# Altium schematic sheet Relay.schdoc
size 291 x 195 mm
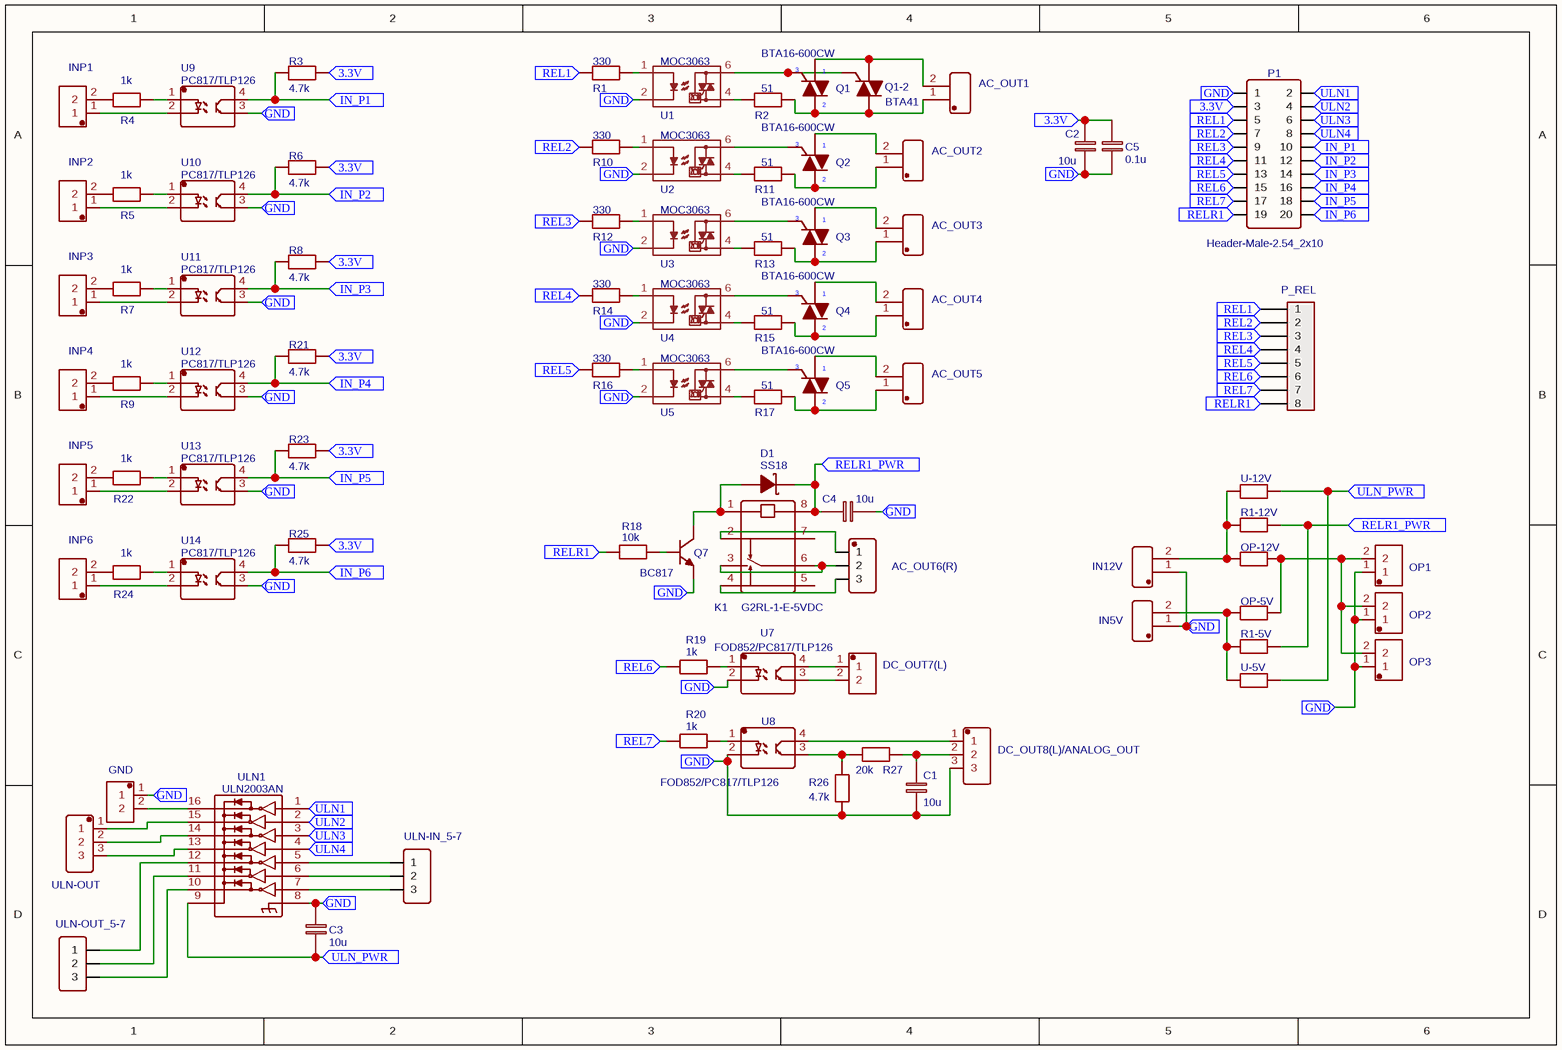
[diagram p0: Relay.schdoc]

## Parts
AC_OUT1  KF129_2P_5.08  [KF129_2P_5.08]  (value not drawn)
AC_OUT2  KF129_2P_5.08  [KF129_2P_5.08]  (value not drawn)
AC_OUT3  KF129_2P_5.08  [KF129_2P_5.08]  (value not drawn)
AC_OUT4  KF129_2P_5.08  [KF129_2P_5.08]  (value not drawn)
AC_OUT5  KF129_2P_5.08  [KF129_2P_5.08]  (value not drawn)
AC_OUT6(R)  KF129_3P_5.08  [KF129_3P_5.08]  (value not drawn)
C1  10u  [1206]
C2  10u  [1206]
C3  10u  [1206]
C4  10u  [1206]
C5  0.1u  [1206]
D1  SS18  [SMA(DO-214AC)]
DC_OUT7(L)  KF350-3.5mm-2p  [KF350-2P]  (value not drawn)
DC_OUT8(L)/ANALOG_OUT  KF350-3P  [KF350-3P]  (value not drawn)
GND  KF350-3.5mm-2p  [KF350-2P]  (value not drawn)
IN5V  KF128_2P_5.08  [KF128_2P_5.08]  (value not drawn)
IN12V  KF128_2P_5.08  [KF128_2P_5.08]  (value not drawn)
INP1  KF350-3.5mm-2p  [KF350-2P]  (value not drawn)
INP2  KF350-3.5mm-2p  [KF350-2P]  (value not drawn)
INP3  KF350-3.5mm-2p  [KF350-2P]  (value not drawn)
INP4  KF350-3.5mm-2p  [KF350-2P]  (value not drawn)
INP5  KF350-3.5mm-2p  [KF350-2P]  (value not drawn)
INP6  KF350-3.5mm-2p  [KF350-2P]  (value not drawn)
K1  G2RL-1-E-5VDC  [G2RL-1-E-CN DC24]
OP1  KF350-3.5mm-2p  [KF350-3.5MM-2P]  (value not drawn)
OP2  KF350-3.5mm-2p  [KF350-3.5MM-2P]  (value not drawn)
OP3  KF350-3.5mm-2p  [KF350-3.5MM-2P]  (value not drawn)
OP-5V  0  [0805]  (value not drawn)
OP-12V  0  [0805]  (value not drawn)
P1  Header-Male-2.54_2x10  [HDR-10X2/2.54]
P_REL  Header-Male-2.54_1x8 with numbers  [HDR-8X1/2.54]  (value not drawn)
Q1  BTA16-600CW  [TO-220(TO-220-3)]
Q1-2  BTA41  [TOP3-1]
Q2  BTA16-600CW  [TO-220(TO-220-3)]
Q3  BTA16-600CW  [TO-220(TO-220-3)]
Q4  BTA16-600CW  [TO-220(TO-220-3)]
Q5  BTA16-600CW  [TO-220(TO-220-3)]
Q7  BC817  [SOT-23(SOT-23-3)]
R1  330  [0805]
R1-5V  0  [0805]  (value not drawn)
R1-12V  0  [0805]  (value not drawn)
R2  51  [1206]
R3  4.7k  [0805]
R4  1k  [0805]
R5  1k  [0805]
R6  4.7k  [0805]
R7  1k  [0805]
R8  4.7k  [0805]
R9  1k  [0805]
R10  330  [0805]
R11  51  [1206]
R12  330  [0805]
R13  51  [1206]
R14  330  [0805]
R15  51  [1206]
R16  330  [0805]
R17  51  [1206]
R18  10k  [0805]
R19  1k  [0805]
R20  1k  [0805]
R21  4.7k  [0805]
R22  1k  [0805]
R23  4.7k  [0805]
R24  1k  [0805]
R25  4.7k  [0805]
R26  4.7k  [0805]
R27  20k  [1206]
U1  MOC3063  [DIP6]
U2  MOC3063  [DIP6]
U3  MOC3063  [DIP6]
U4  MOC3063  [DIP6]
U5  MOC3063  [DIP6]
U7  FOD852/PC817/TLP126  [PC817-DIP/SMD]
U8  FOD852/PC817/TLP126  [PC817-DIP/SMD]
U9  PC817/TLP126  [PC817-DIP/SMD]
U10  PC817/TLP126  [PC817-DIP/SMD]
U11  PC817/TLP126  [PC817-DIP/SMD]
U12  PC817/TLP126  [PC817-DIP/SMD]
U13  PC817/TLP126  [PC817-DIP/SMD]
U14  PC817/TLP126  [PC817-DIP/SMD]
U-5V  0  [0805]  (value not drawn)
U-12V  0  [0805]  (value not drawn)
ULN1  ULN2003AN  [DIP-16_16PIN-LS7.62-L19.69-W6.6-H5.08-PITCH2.54]
ULN-IN_5-7  Header-Male-2.54_1x3  [HDR-3X1/2.54]  (value not drawn)
ULN-OUT  KF350-3P  [KF350-3P]  (value not drawn)
ULN-OUT_5-7  Header-Male-2.54_1x3  [HDR-3X1/2.54]  (value not drawn)

## Ports
3.3V, GND, IN_P1, IN_P2, IN_P3, IN_P4, IN_P5, IN_P6, REL1, REL2, REL3, REL4, REL5, REL6, REL7, RELR1, RELR1_PWR, ULN1, ULN2, ULN3, ULN4, ULN_PWR

## Nets
3.3V: C2.1 C5.1 P1.3 R3.2 R6.2 R8.2 R21.2 R23.2 R25.2 ; port 3.3V
GND: C1.2 C2.2 C3.1 C4.2 C5.2 DC_OUT8(L)/ANALOG_OUT.3 GND.1 IN5V.1(PIN1) IN12V.1(PIN1) OP1.1 OP2.1 OP3.1 P1.1 Q7.2(E) R26.2 U1.2 U2.2 U3.2 U4.2 U5.2 U7.2(C) U8.2(C) U9.3(E) U10.3(E) U11.3(E) U12.3(E) U13.3(E) U14.3(E) ULN1.8(E) ; port GND
IN_P1: P1.10 R3.1 U9.4(C) ; port IN_P1
IN_P2: P1.12 R6.1 U10.4(C) ; port IN_P2
IN_P3: P1.14 R8.1 U11.4(C) ; port IN_P3
IN_P4: P1.16 R21.1 U12.4(C) ; port IN_P4
IN_P5: P1.18 R23.1 U13.4(C) ; port IN_P5
IN_P6: P1.20 R25.1 U14.4(C) ; port IN_P6
REL1: P1.5 P_REL.1 R1.1 ; port REL1
REL2: P1.7 P_REL.2 R10.1 ; port REL2
REL3: P1.9 P_REL.3 R12.1 ; port REL3
REL4: P1.11 P_REL.4 R14.1 ; port REL4
REL5: P1.13 P_REL.5 R16.1 ; port REL5
REL6: P1.15 P_REL.6 R19.1 ; port REL6
REL7: P1.17 P_REL.7 R20.1 ; port REL7
RELR1: P1.19 P_REL.8 R18.1 ; port RELR1
RELR1_PWR: C4.1 D1.2(K) K1.8(COL2) R1-5V.2 R1-12V.2 ; port RELR1_PWR
ULN1: P1.2 ULN1.1(1B) ; port ULN1
ULN2: P1.4 ULN1.2(2B) ; port ULN2
ULN3: P1.6 ULN1.3(3B) ; port ULN3
ULN4: P1.8 ULN1.4(4B) ; port ULN4
ULN_PWR: C3.2 U-5V.2 U-12V.2 ULN1.9(COM) ; port ULN_PWR
NetAC_OUT1_1: AC_OUT1.1(PIN1) Q1.2(M2) Q1-2.2(M2) R2.2
NetAC_OUT1_2: AC_OUT1.2(PIN2) Q1.1(M1) Q1-2.1(M1)
NetAC_OUT2_1: AC_OUT2.1(PIN1) Q2.2(M2) R11.2
NetAC_OUT2_2: AC_OUT2.2(PIN2) Q2.1(M1)
NetAC_OUT3_1: AC_OUT3.1(PIN1) Q3.2(M2) R13.2
NetAC_OUT3_2: AC_OUT3.2(PIN2) Q3.1(M1)
NetAC_OUT4_1: AC_OUT4.1(PIN1) Q4.2(M2) R15.2
NetAC_OUT4_2: AC_OUT4.2(PIN2) Q4.1(M1)
NetAC_OUT5_1: AC_OUT5.1(PIN1) Q5.2(M2) R17.2
NetAC_OUT5_2: AC_OUT5.2(PIN2) Q5.1(M1)
NetAC_OUT6(R)_1: AC_OUT6(R).1 K1.2(NC)
NetAC_OUT6(R)_2: AC_OUT6(R).2 K1.3(COM) K1.6(COM)
NetAC_OUT6(R)_3: AC_OUT6(R).3 K1.4(NO)
NetC1_1: C1.1 DC_OUT8(L)/ANALOG_OUT.2 R27.2
NetD1_1: D1.1(A) K1.1(COL1) Q7.3(C)
NetDC_OUT7(L)_1: DC_OUT7(L).1 U7.4(C)
NetDC_OUT7(L)_2: DC_OUT7(L).2 U7.3(E)
NetDC_OUT8(L)/ANALOG_OUT_1: DC_OUT8(L)/ANALOG_OUT.1 U8.4(C)
NetGND_2: GND.2 ULN1.16(1C)
NetIN5V_2: IN5V.2(PIN2) OP-5V.1 R1-5V.1 U-5V.1
NetIN12V_2: IN12V.2(PIN2) OP-12V.1 R1-12V.1 U-12V.1
NetINP1_1: INP1.1 U9.2(C)
NetINP1_2: INP1.2 R4.1
NetINP2_1: INP2.1 U10.2(C)
NetINP2_2: INP2.2 R5.1
NetINP3_1: INP3.1 U11.2(C)
NetINP3_2: INP3.2 R7.1
NetINP4_1: INP4.1 U12.2(C)
NetINP4_2: INP4.2 R9.1
NetINP5_1: INP5.1 U13.2(C)
NetINP5_2: INP5.2 R22.1
NetINP6_1: INP6.1 U14.2(C)
NetINP6_2: INP6.2 R24.1
NetOP1_2: OP1.2 OP2.2 OP3.2 OP-5V.2 OP-12V.2
NetQ1_3: Q1.3(G) Q1-2.3(G) U1.6
NetQ2_3: Q2.3(G) U2.6
NetQ3_3: Q3.3(G) U3.6
NetQ4_3: Q4.3(G) U4.6
NetQ5_3: Q5.3(G) U5.6
NetQ7_1: Q7.1(B) R18.2
NetR1_2: R1.2 U1.1
NetR2_1: R2.1 U1.4
NetR4_2: R4.2 U9.1(A)
NetR5_2: R5.2 U10.1(A)
NetR7_2: R7.2 U11.1(A)
NetR9_2: R9.2 U12.1(A)
NetR10_2: R10.2 U2.1
NetR11_1: R11.1 U2.4
NetR12_2: R12.2 U3.1
NetR13_1: R13.1 U3.4
NetR14_2: R14.2 U4.1
NetR15_1: R15.1 U4.4
NetR16_2: R16.2 U5.1
NetR17_1: R17.1 U5.4
NetR19_2: R19.2 U7.1(A)
NetR20_2: R20.2 U8.1(A)
NetR22_2: R22.2 U13.1(A)
NetR24_2: R24.2 U14.1(A)
NetR26_1: R26.1 R27.1 U8.3(E)
NetULN1_5: ULN1.5(5B) ULN-IN_5-7.1
NetULN1_6: ULN1.6(6B) ULN-IN_5-7.2
NetULN1_7: ULN1.7(7B) ULN-IN_5-7.3
NetULN1_10: ULN1.10(7C) ULN-OUT_5-7.3
NetULN1_11: ULN1.11(6C) ULN-OUT_5-7.2
NetULN1_12: ULN1.12(5C) ULN-OUT_5-7.1
NetULN1_13: ULN1.13(4C) ULN-OUT.3
NetULN1_14: ULN1.14(3C) ULN-OUT.2
NetULN1_15: ULN1.15(2C) ULN-OUT.1

Not connected (* = marked no-connect by the designer): K1 5(NO) 7(NC)

## Library data of the parts
AC_OUT1-AC_OUT5 = KF129_2P_5.08: BOM_Manufacturer: Kefa Electronics; BOM_Manufacturer Part: KF129L-5.08; Contributor: GrahamG; BOM_Supplier Part: undefined; spicePre: J
AC_OUT6(R) = KF129_3P_5.08: BOM_Manufacturer: Molex; Contributor: GrahamG; BOM_Manufacturer Part: ?; spicePre: P
C1-C4 = 10u: nameAlias: Value(F); BOM_Manufacturer Part: ?; spicePre: C; spiceSymbolName: Cap_1206_EU
C5 = 0.1u: nameAlias: Value(F); BOM_Manufacturer Part: ?; spicePre: C; spiceSymbolName: Cap_1206_EU
D1 = SS18: BOM_Manufacturer: MDD; SMT Type: Extend; BOM_Supplier: LCSC; BOM_Manufacturer Part: SS18; image: //image.lceda.cn/szlcsc/C64986.jpg; BOM_Supplier Part: C64986; BOM_LCSC Assembly: Yes; spicePre: D
DC_OUT7(L) GND INP1-INP6 OP1-OP3 = KF350-3.5mm-2p: BOM_Manufacturer: ReliaPro; BOM_Manufacturer Part: WJ2EDGVC-5.08-2P; spicePre: X; BOM_Supplier Part: C8445; BOM_Supplier: LCSC
DC_OUT8(L)/ANALOG_OUT ULN-OUT = KF350-3P: BOM_Manufacturer: ReliaPro; BOM_Manufacturer Part: WJ2EDGK-5.08-3P-14-00A; spicePre: X; BOM_Supplier Part: C71371; BOM_Supplier: LCSC
IN5V IN12V = KF128_2P_5.08: BOM_Manufacturer: Kefa Electronics; BOM_Manufacturer Part: KF128L-5.08; Contributor: GrahamG; spicePre: J
K1 = G2RL-1-E-5VDC: BOM_Manufacturer: Omron Electronics; Contributor: LCSC; BOM_Supplier: LCSC; BOM_Supplier Part: C231363; BOM_Manufacturer Part: -; spicePre: K
OP-5V OP-12V R1-5V R1-12V U-5V U-12V = 0: nameAlias: Value(Ω); BOM_Manufacturer Part: ?; spicePre: R; spiceSymbolName: Res_0805(1/8W)_EU
P_REL = Header-Male-2.54_1x8 with numbers: BOM_Manufacturer: EasyEDA; BOM_EasyEDA: E49256; BOM_Supplier Part: E49256; BOM_Supplier: EasyEDA; BOM_Manufacturer Part: Header-Male-2.54_1x8; spicePre: P
Q1-Q5 = BTA16-600CW: BOM_Manufacturer: STMicroelectronics; BOM_Manufacturer Part: BTA16-600CWRG; BOM_Supplier: LCSC; BOM_Supplier Part: C84597; spicePre: Q
Q1-2 = BTA41: BOM_Manufacturer: STMicroelectronics; BOM_Manufacturer Part: BTA41-600BRG; Contributor: LCSC; BOM_Supplier: LCSC; image: //image.lceda.cn/szlcsc/C9103.jpg; BOM_Supplier Part: C9103; spicePre: Q
Q7 = BC817: BOM_Manufacturer: CJ; SMT Type: Extend; BOM_Supplier: LCSC; BOM_Manufacturer Part: BC817; image: //image.lceda.cn/szlcsc/C8589.jpg; BOM_Supplier Part: C8589; BOM_LCSC Assembly: Yes; spicePre: Q
R1 R10 R12 R14 R16 = 330: nameAlias: Value(Ω); BOM_Manufacturer Part: ?; spicePre: R; spiceSymbolName: Res_0805(1/8W)_EU
R2 R11 R13 R15 R17 = 51: nameAlias: Value(Ω); BOM_Manufacturer Part: ?; spicePre: R; spiceSymbolName: Res_1206(1/4W)_EU
R3 R6 R8 R21 R23 R25 R26 = 4.7k: nameAlias: Value(Ω); BOM_Manufacturer Part: ?; spicePre: R; spiceSymbolName: Res_0805(1/8W)_EU
R4 R5 R7 R9 R19 R20 R22 R24 = 1k: nameAlias: Value(Ω); BOM_Manufacturer Part: ?; spicePre: R; spiceSymbolName: Res_0805(1/8W)_EU
R18 = 10k: nameAlias: Value(Ω); BOM_Manufacturer Part: ?; spicePre: R; spiceSymbolName: Res_0805(1/8W)_EU
R27 = 20k: nameAlias: Value(Ω); BOM_Manufacturer Part: ?; spicePre: R; spiceSymbolName: Res_1206(1/4W)_EU
U1-U5 = MOC3063: Contributor: KiCad; BOM_Manufacturer Part: ?; spicePre: U
U7 U8 = FOD852/PC817/TLP126: BOM_Manufacturer: ON Semicon; BOM_Manufacturer Part: FOD852SD; Contributor: LCSC; SMT Type: Extend; BOM_Supplier: LCSC; BOM_Supplier Part: C258252; BOM_LCSC Assembly: Yes; spicePre: U
U9-U14 = PC817/TLP126: BOM_Manufacturer: ON Semicon; BOM_Manufacturer Part: FOD852SD; Contributor: LCSC; SMT Type: Extend; BOM_Supplier: LCSC; BOM_Supplier Part: C258252; BOM_LCSC Assembly: Yes; spicePre: U
ULN1 = ULN2003AN: BOM_Manufacturer: TI; BOM_Supplier: LCSC; BOM_Manufacturer Part: ULN2003AN; BOM_Supplier Part: C90448; spicePre: U
ULN-IN_5-7 ULN-OUT_5-7 = Header-Male-2.54_1x3: BOM_Manufacturer: BOOMELE; BOM_Manufacturer Part: Header2.54mm 1*3P; BOM_Supplier: LCSC; image: //image.lceda.cn/szlcsc/C49257.jpg; BOM_Supplier Part: C49257; spicePre: P
P1 = Header-Male-2.54_2x10: BOM_Supplier: LCSC; image: http://image.lceda.cn/szlcsc/C62032.jpg; BOM_Supplier Part: C62032; BOM_Manufacturer Part: ?; spicePre: P